# Altium project DBL TLC5940 driver for High load.PrjPcb
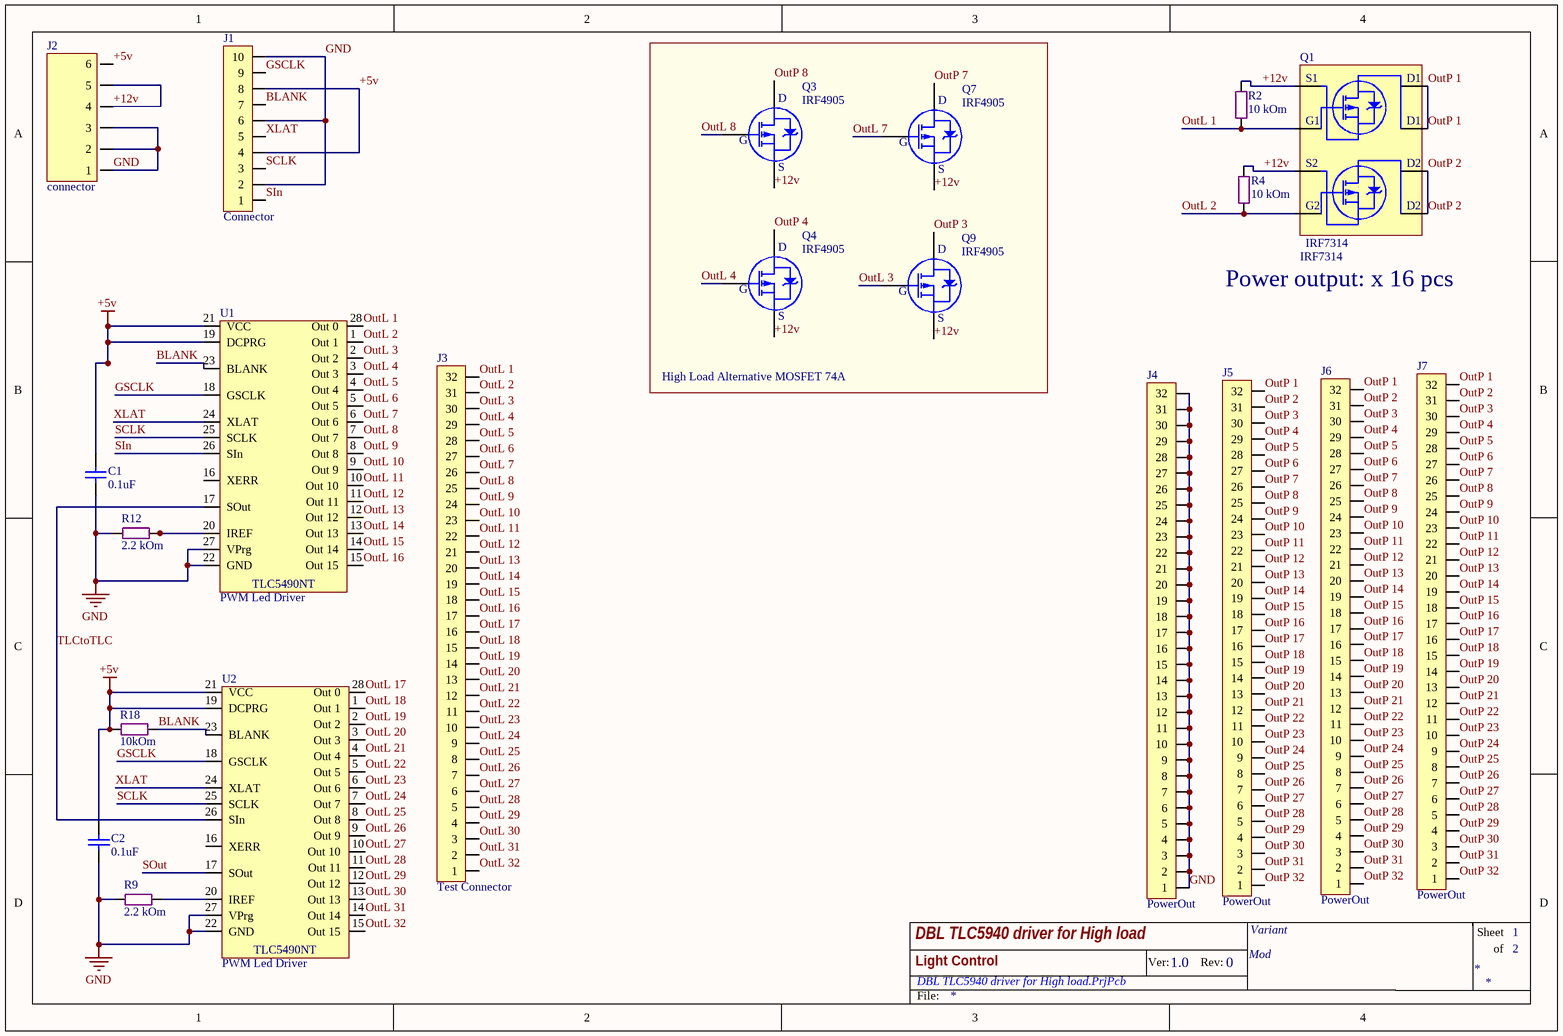
[diagram p0: DBL TLC5940 driver for High load.SchDoc]
2 sheets, 66 parts. Net scope: global (net labels, ports and power ports of the same name join across sheets).
Board file: DBL TLC5940 driver for High load.PcbDoc
Sheets:
  DBL TLC5940 driver for High load.SchDoc
  DBL TLC5940 driver for High load - 5.3A MOSFET.SchDoc

## Sheet DBL TLC5940 driver for High load.SchDoc: DBL TLC5940 driver for High load
size A4; Revision: 0; SheetNumber: 1; SheetTotal: 2; Version: 1.0; Variant: Variant; Modification: Mod; Project: Light Control; PageSetup: Record=PageOptions|CenterHorizontal=True|CenterVertical=True|PrintScale=0.97|XCorrection=1.00|YCorrection=1.00|PrintKind=1|BorderSize=5000000|LeftOffset=0|BottomOffset=0|Orientation=2|PaperLength=2970|PaperWidth=2100|Scale=100|PaperSource=7|PrintQuality=-4|MediaType=1|DitherType=10|PaperKind=A4|PrintScaleMode=1

### Parts
C1  0.1uF  [SMD 0805 (2012)]
C2  0.1uF  [SMD 0805 (2012)]
J1  Connector  [LINE 2.54 x 10D (2 x 5) - BH]
J2  connector  [Molex Mini-Fit Jr - 6Pin R]
J3  Test Connector  [LINE 2.54 x 32]
J4  PowerOut  [LINE 2.54 x 32]
J5  PowerOut  [LINE 2.54 x 32]
J6  PowerOut  [LINE 2.54 x 32]
J7  PowerOut  [LINE 2.54 x 32]
Q1  IRF7314  [SO8]
Q3  IRF4905  [TO220-2]
Q4  IRF4905  [TO220-2]
Q7  IRF4905  [TO220-2]
Q9  IRF4905  [TO220-2]
R2  10 kOm  [SMD 0805 (2012)]
R4  10 kOm  [SMD 0805 (2012)]
R9  2.2 kOm  [SMD 0805 (2012)]
R12  2.2 kOm  [SMD 0805 (2012)]
R18  10kOm  [SMD 0805 (2012)]
U1  PWM Led Driver  [DIP-28 (OVAL)]
U2  PWM Led Driver  [DIP-28 (OVAL)]

### Blocks framed on the sheet
High Load Alternative MOSFET 74A: Q3 Q4 Q7 Q9

### Nets
+5v: C1.1 C2.1 J1.4 J1.8 J2.6 R18.1 U1.19(DCPRG) U1.21(VCC) U2.19(DCPRG) U2.21(VCC)
GND: C1.2 C2.2 J1.2 J1.6 J1.10 J2.1 J2.2 J2.3 J4.1 J4.2 J4.3 J4.4 J4.5 J4.6 J4.7 J4.8 J4.9 J4.10 J4.11 J4.12 J4.13 J4.14 J4.15 J4.16 J4.17 J4.18 J4.19 J4.20 J4.21 J4.22 J4.23 J4.24 J4.25 J4.26 J4.27 J4.28 J4.29 J4.30 J4.31 J4.32 R9.2 R12.2 U1.22(GND) U1.27(VPrg) U2.22(GND) U2.27(VPrg)
+12v: J2.4 J2.5 Q1.1(S) Q1.3(S) Q3.3(S) Q4.3(S) Q7.3(S) Q9.3(S) R2.2 R4.2
BLANK: J1.7 R18.2 U1.23(BLANK) U2.23(BLANK)
GSCLK: J1.9 U1.18(GSCLK) U2.18(GSCLK)
OutL 1: J3.32 Q1.2(G) R2.1 U1.28(Out_0)
OutL 2: J3.31 Q1.4(G) R4.1 U1.1(Out_1)
OutL 3: J3.30 Q9.1(G) U1.2(Out_2)
OutL 4: J3.29 Q4.1(G) U1.3(Out_3)
OutL 5: J3.28 U1.4(Out_4)
OutL 6: J3.27 U1.5(Out_5)
OutL 7: J3.26 Q7.1(G) U1.6(Out_6)
OutL 8: J3.25 Q3.1(G) U1.7(Out_7)
OutL 9: J3.24 U1.8(Out_8)
OutL 10: J3.23 U1.9(Out_9)
OutL 11: J3.22 U1.10(Out_10)
OutL 12: J3.21 U1.11(Out_11)
OutL 13: J3.20 U1.12(Out_12)
OutL 14: J3.19 U1.13(Out_13)
OutL 15: J3.18 U1.14(Out_14)
OutL 16: J3.17 U1.15(Out_15)
OutL 17: J3.16 U2.28(Out_0)
OutL 18: J3.15 U2.1(Out_1)
OutL 19: J3.14 U2.2(Out_2)
OutL 20: J3.13 U2.3(Out_3)
OutL 21: J3.12 U2.4(Out_4)
OutL 22: J3.11 U2.5(Out_5)
OutL 23: J3.10 U2.6(Out_6)
OutL 24: J3.9 U2.7(Out_7)
OutL 25: J3.8 U2.8(Out_8)
OutL 26: J3.7 U2.9(Out_9)
OutL 27: J3.6 U2.10(Out_10)
OutL 28: J3.5 U2.11(Out_11)
OutL 29: J3.4 U2.12(Out_12)
OutL 30: J3.3 U2.13(Out_13)
OutL 31: J3.2 U2.14(Out_14)
OutL 32: J3.1 U2.15(Out_15)
OutP 1: J5.32 J6.32 J7.32 Q1.7(D) Q1.8(D)
OutP 2: J5.31 J6.31 J7.31 Q1.5(D) Q1.6(D)
OutP 3: J5.30 J6.30 J7.30 Q9.2(D)
OutP 4: J5.29 J6.29 J7.29 Q4.2(D)
OutP 5: J5.28 J6.28 J7.28
OutP 6: J5.27 J6.27 J7.27
OutP 7: J5.26 J6.26 J7.26 Q7.2(D)
OutP 8: J5.25 J6.25 J7.25 Q3.2(D)
OutP 9: J5.24 J6.24 J7.24
OutP 10: J5.23 J6.23 J7.23
OutP 11: J5.22 J6.22 J7.22
OutP 12: J5.21 J6.21 J7.21
OutP 13: J5.20 J6.20 J7.20
OutP 14: J5.19 J6.19 J7.19
OutP 15: J5.18 J6.18 J7.18
OutP 16: J5.17 J6.17 J7.17
OutP 17: J5.16 J6.16 J7.16
OutP 18: J5.15 J6.15 J7.15
OutP 19: J5.14 J6.14 J7.14
OutP 20: J5.13 J6.13 J7.13
OutP 21: J5.12 J6.12 J7.12
OutP 22: J5.11 J6.11 J7.11
OutP 23: J5.10 J6.10 J7.10
OutP 24: J5.9 J6.9 J7.9
OutP 25: J5.8 J6.8 J7.8
OutP 26: J5.7 J6.7 J7.7
OutP 27: J5.6 J6.6 J7.6
OutP 28: J5.5 J6.5 J7.5
OutP 29: J5.4 J6.4 J7.4
OutP 30: J5.3 J6.3 J7.3
OutP 31: J5.2 J6.2 J7.2
OutP 32: J5.1 J6.1 J7.1
SCLK: J1.3 U1.25(SCLK) U2.25(SCLK)
SIn: J1.1 U1.26(SIn)
SOut: U2.17(SOut)
TLCtoTLC: U1.17(SOut) U2.26(SIn)
XLAT: J1.5 U1.24(XLAT) U2.24(XLAT)
NetR9_1: R9.1 U2.20(IREF)
NetR12_1: R12.1 U1.20(IREF)

Not connected (* = marked no-connect by the designer): U1 16(XERR); U2 16(XERR)

### Notes on the sheet
- Power output: x 16 pcs
- Ver:
- Rev:
- Sheet
- of
- File:
- (in symbol IRF7314) S1; D1; G1; S2; D2; G2
- (in symbol TLC5940) TLC5490NT

### Library data of the parts
C1 C2 = Cap SMD 0402-1812: Capacitor
J1 = PLD-10 (2 x 5): Vert, Dbl line, Male
J2 = Molex Mini-Fit Jr - 6 pin: Right, Dbl line, Female
J3-J7 = PLS-32: Vert, Sgl line, Male
Q1 = IRF7314: Dual P-Ch  20V - 0.058Ω - 5.3A; Monufacturer: IOR; RDS Сопротивление Сток-Исток: 0.058 Om; I d - Drain current (continuous) at TC = 100°C: 4.3 A; VGS Порог Открытия: -0.7 V; VGS Макс напр на гейте: +-12 V; C ISS Входная емкость: 780 pF; C OSS Выходная емкость: 470 pF; V DSS (v): 20V; I d - Drain current (continuous) at TC = 25°C: 5.3 A; Name: IRF7314; Datasheet: http://tec.org.ru/_bd/2/277_IRF7314-IR.pdf; URL: http://tec.org.ru/board/49-1-0-277
Q3 Q4 Q7 Q9 = IRF4905: P-Channel 55V - 0.02Ω - 74A; Monufacturer: IOR; RDS Сопротивление Сток-Исток: 0.02 Om; I d - Drain current (continuous) at TC = 100°C: 55 A; VGS Порог Открытия: -2....-4 V; VGS Макс напр на гейте: +-20 V; C ISS Входная емкость: 3400 pF; C OSS Выходная емкость: 1400 pF; V DSS (v): 55V; I d - Drain current (continuous) at TC = 25°C: 74 A; Name: IRF4905; Datasheet: http://tec.org.ru/_bd/32/3287_IRF4905.pdf; URL: http://tec.org.ru/board/irf4905/49-1-0-3287
R2 R4 R9 R12 R18 = Res All Types
U1 U2 = TLC5940: 16-Channel LED Driver With DOT Correction and Grayscale PWM Control; DataSheet: http://www.ti.com/lit/ds/symlink/tlc5940.pdf

## Sheet DBL TLC5940 driver for High load - 5.3A MOSFET.SchDoc: DBL TLC5940 driver for High load - 5.3A MOSFET
size A4; Revision: 0; SheetNumber: 2; SheetTotal: 2; Version: 1.0; Variant: 5.3 A MOSFET; Modification: Mod; Project: Light Control
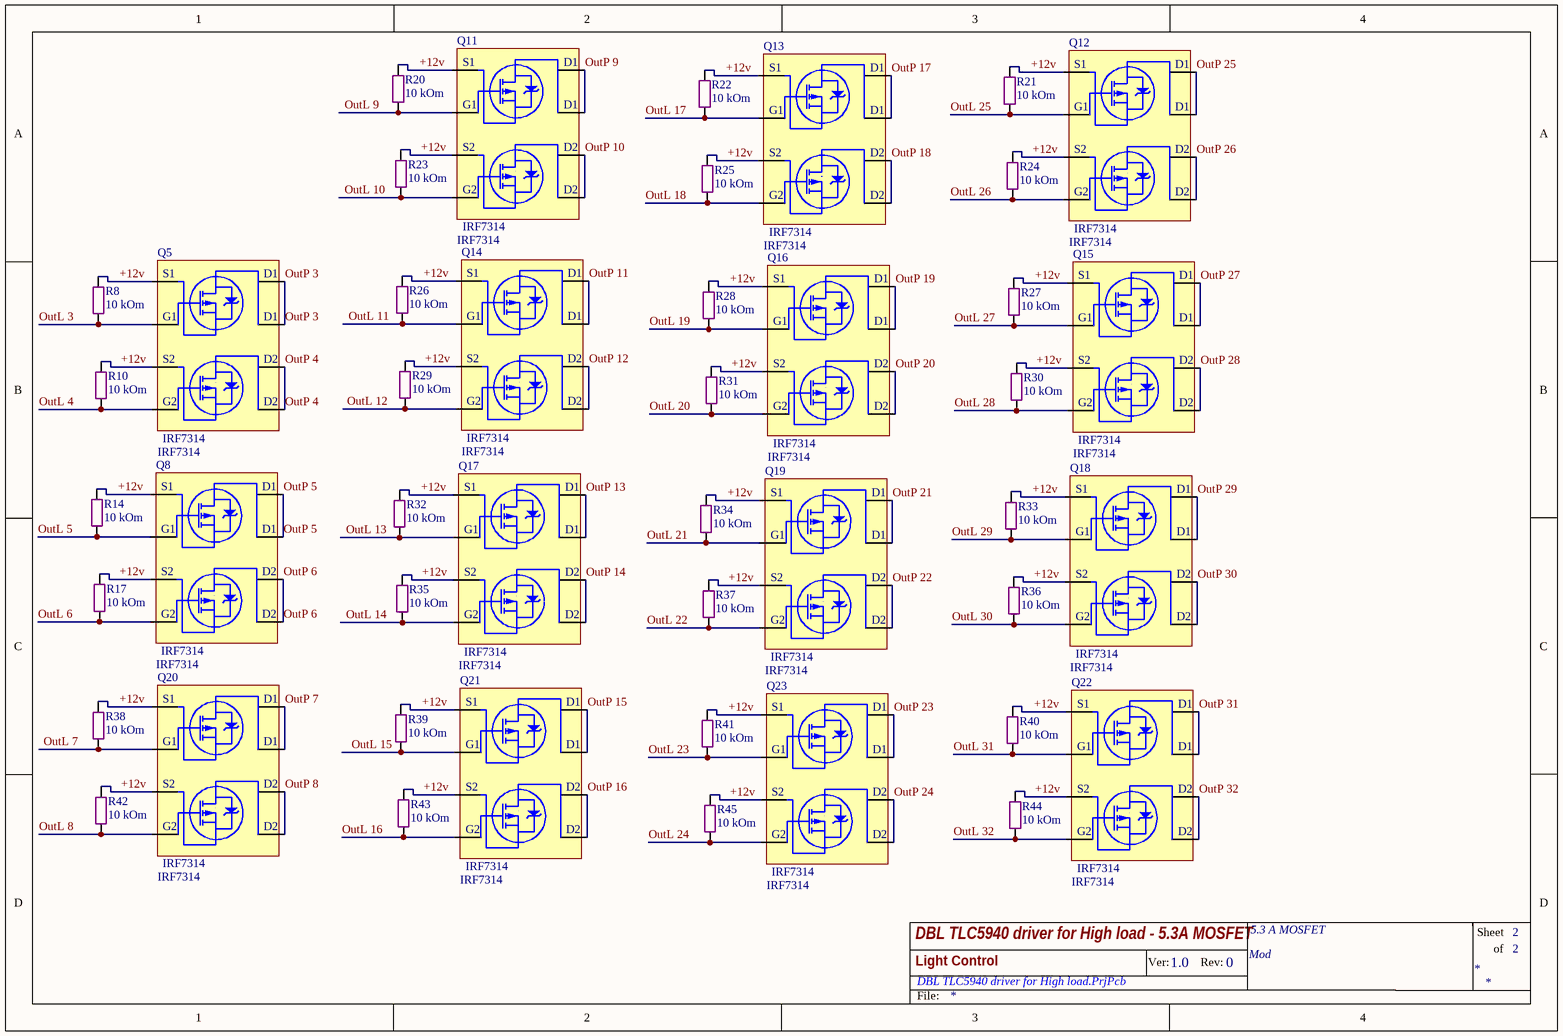
[diagram p1: DBL TLC5940 driver for High load - 5.3A MOSFET.SchDoc]

### Parts
Q5  IRF7314  [SO8]
Q8  IRF7314  [SO8]
Q11  IRF7314  [SO8]
Q12  IRF7314  [SO8]
Q13  IRF7314  [SO8]
Q14  IRF7314  [SO8]
Q15  IRF7314  [SO8]
Q16  IRF7314  [SO8]
Q17  IRF7314  [SO8]
Q18  IRF7314  [SO8]
Q19  IRF7314  [SO8]
Q20  IRF7314  [SO8]
Q21  IRF7314  [SO8]
Q22  IRF7314  [SO8]
Q23  IRF7314  [SO8]
R8  10 kOm  [SMD 0805 (2012)]
R10  10 kOm  [SMD 0805 (2012)]
R14  10 kOm  [SMD 0805 (2012)]
R17  10 kOm  [SMD 0805 (2012)]
R20  10 kOm  [SMD 0805 (2012)]
R21  10 kOm  [SMD 0805 (2012)]
R22  10 kOm  [SMD 0805 (2012)]
R23  10 kOm  [SMD 0805 (2012)]
R24  10 kOm  [SMD 0805 (2012)]
R25  10 kOm  [SMD 0805 (2012)]
R26  10 kOm  [SMD 0805 (2012)]
R27  10 kOm  [SMD 0805 (2012)]
R28  10 kOm  [SMD 0805 (2012)]
R29  10 kOm  [SMD 0805 (2012)]
R30  10 kOm  [SMD 0805 (2012)]
R31  10 kOm  [SMD 0805 (2012)]
R32  10 kOm  [SMD 0805 (2012)]
R33  10 kOm  [SMD 0805 (2012)]
R34  10 kOm  [SMD 0805 (2012)]
R35  10 kOm  [SMD 0805 (2012)]
R36  10 kOm  [SMD 0805 (2012)]
R37  10 kOm  [SMD 0805 (2012)]
R38  10 kOm  [SMD 0805 (2012)]
R39  10 kOm  [SMD 0805 (2012)]
R40  10 kOm  [SMD 0805 (2012)]
R41  10 kOm  [SMD 0805 (2012)]
R42  10 kOm  [SMD 0805 (2012)]
R43  10 kOm  [SMD 0805 (2012)]
R44  10 kOm  [SMD 0805 (2012)]
R45  10 kOm  [SMD 0805 (2012)]

### Nets
+12v: Q5.1(S) Q5.3(S) Q8.1(S) Q8.3(S) Q11.1(S) Q11.3(S) Q12.1(S) Q12.3(S) Q13.1(S) Q13.3(S) Q14.1(S) Q14.3(S) Q15.1(S) Q15.3(S) Q16.1(S) Q16.3(S) Q17.1(S) Q17.3(S) Q18.1(S) Q18.3(S) Q19.1(S) Q19.3(S) Q20.1(S) Q20.3(S) Q21.1(S) Q21.3(S) Q22.1(S) Q22.3(S) Q23.1(S) Q23.3(S) R8.2 R10.2 R14.2 R17.2 R20.2 R21.2 R22.2 R23.2 R24.2 R25.2 R26.2 R27.2 R28.2 R29.2 R30.2 R31.2 R32.2 R33.2 R34.2 R35.2 R36.2 R37.2 R38.2 R39.2 R40.2 R41.2 R42.2 R43.2 R44.2 R45.2
OutL 3: Q5.2(G) R8.1
OutL 4: Q5.4(G) R10.1
OutL 5: Q8.2(G) R14.1
OutL 6: Q8.4(G) R17.1
OutL 7: Q20.2(G) R38.1
OutL 8: Q20.4(G) R42.1
OutL 9: Q11.2(G) R20.1
OutL 10: Q11.4(G) R23.1
OutL 11: Q14.2(G) R26.1
OutL 12: Q14.4(G) R29.1
OutL 13: Q17.2(G) R32.1
OutL 14: Q17.4(G) R35.1
OutL 15: Q21.2(G) R39.1
OutL 16: Q21.4(G) R43.1
OutL 17: Q13.2(G) R22.1
OutL 18: Q13.4(G) R25.1
OutL 19: Q16.2(G) R28.1
OutL 20: Q16.4(G) R31.1
OutL 21: Q19.2(G) R34.1
OutL 22: Q19.4(G) R37.1
OutL 23: Q23.2(G) R41.1
OutL 24: Q23.4(G) R45.1
OutL 25: Q12.2(G) R21.1
OutL 26: Q12.4(G) R24.1
OutL 27: Q15.2(G) R27.1
OutL 28: Q15.4(G) R30.1
OutL 29: Q18.2(G) R33.1
OutL 30: Q18.4(G) R36.1
OutL 31: Q22.2(G) R40.1
OutL 32: Q22.4(G) R44.1
OutP 3: Q5.7(D) Q5.8(D)
OutP 4: Q5.5(D) Q5.6(D)
OutP 5: Q8.7(D) Q8.8(D)
OutP 6: Q8.5(D) Q8.6(D)
OutP 7: Q20.7(D) Q20.8(D)
OutP 8: Q20.5(D) Q20.6(D)
OutP 9: Q11.7(D) Q11.8(D)
OutP 10: Q11.5(D) Q11.6(D)
OutP 11: Q14.7(D) Q14.8(D)
OutP 12: Q14.5(D) Q14.6(D)
OutP 13: Q17.7(D) Q17.8(D)
OutP 14: Q17.5(D) Q17.6(D)
OutP 15: Q21.7(D) Q21.8(D)
OutP 16: Q21.5(D) Q21.6(D)
OutP 17: Q13.7(D) Q13.8(D)
OutP 18: Q13.5(D) Q13.6(D)
OutP 19: Q16.7(D) Q16.8(D)
OutP 20: Q16.5(D) Q16.6(D)
OutP 21: Q19.7(D) Q19.8(D)
OutP 22: Q19.5(D) Q19.6(D)
OutP 23: Q23.7(D) Q23.8(D)
OutP 24: Q23.5(D) Q23.6(D)
OutP 25: Q12.7(D) Q12.8(D)
OutP 26: Q12.5(D) Q12.6(D)
OutP 27: Q15.7(D) Q15.8(D)
OutP 28: Q15.5(D) Q15.6(D)
OutP 29: Q18.7(D) Q18.8(D)
OutP 30: Q18.5(D) Q18.6(D)
OutP 31: Q22.7(D) Q22.8(D)
OutP 32: Q22.5(D) Q22.6(D)

### Notes on the sheet
- Ver:
- Rev:
- Sheet
- of
- File:
- (in symbol IRF7314) S1; D1; G1; S2; D2; G2

### Library data of the parts
Q5 Q8 Q11-Q23 = IRF7314: as Q1 on sheet DBL TLC5940 driver for High load; V DSS (v): 20V; I d - Drain current (continuous) at TC = 25°C: 5.3 A; Name: IRF7314; Datasheet: http://tec.org.ru/_bd/2/277_IRF7314-IR.pdf; URL: http://tec.org.ru/board/49-1-0-277
R8 R10 R14 R17 R20-R45 = Res All Types

## Nets that join several sheets
+12v: DBL TLC5940 driver for High load (10 pins), DBL TLC5940 driver for High load - 5.3A MOSFET (60 pins)
OutL 3: DBL TLC5940 driver for High load (J3.30 Q9.1 U1.2), DBL TLC5940 driver for High load - 5.3A MOSFET (Q5.2 R8.1)
OutL 4: DBL TLC5940 driver for High load (J3.29 Q4.1 U1.3), DBL TLC5940 driver for High load - 5.3A MOSFET (Q5.4 R10.1)
OutL 5: DBL TLC5940 driver for High load (J3.28 U1.4), DBL TLC5940 driver for High load - 5.3A MOSFET (Q8.2 R14.1)
OutL 6: DBL TLC5940 driver for High load (J3.27 U1.5), DBL TLC5940 driver for High load - 5.3A MOSFET (Q8.4 R17.1)
OutL 7: DBL TLC5940 driver for High load (J3.26 Q7.1 U1.6), DBL TLC5940 driver for High load - 5.3A MOSFET (Q20.2 R38.1)
OutL 8: DBL TLC5940 driver for High load (J3.25 Q3.1 U1.7), DBL TLC5940 driver for High load - 5.3A MOSFET (Q20.4 R42.1)
OutL 9: DBL TLC5940 driver for High load (J3.24 U1.8), DBL TLC5940 driver for High load - 5.3A MOSFET (Q11.2 R20.1)
OutL 10: DBL TLC5940 driver for High load (J3.23 U1.9), DBL TLC5940 driver for High load - 5.3A MOSFET (Q11.4 R23.1)
OutL 11: DBL TLC5940 driver for High load (J3.22 U1.10), DBL TLC5940 driver for High load - 5.3A MOSFET (Q14.2 R26.1)
OutL 12: DBL TLC5940 driver for High load (J3.21 U1.11), DBL TLC5940 driver for High load - 5.3A MOSFET (Q14.4 R29.1)
OutL 13: DBL TLC5940 driver for High load (J3.20 U1.12), DBL TLC5940 driver for High load - 5.3A MOSFET (Q17.2 R32.1)
OutL 14: DBL TLC5940 driver for High load (J3.19 U1.13), DBL TLC5940 driver for High load - 5.3A MOSFET (Q17.4 R35.1)
OutL 15: DBL TLC5940 driver for High load (J3.18 U1.14), DBL TLC5940 driver for High load - 5.3A MOSFET (Q21.2 R39.1)
OutL 16: DBL TLC5940 driver for High load (J3.17 U1.15), DBL TLC5940 driver for High load - 5.3A MOSFET (Q21.4 R43.1)
OutL 17: DBL TLC5940 driver for High load (J3.16 U2.28), DBL TLC5940 driver for High load - 5.3A MOSFET (Q13.2 R22.1)
OutL 18: DBL TLC5940 driver for High load (J3.15 U2.1), DBL TLC5940 driver for High load - 5.3A MOSFET (Q13.4 R25.1)
OutL 19: DBL TLC5940 driver for High load (J3.14 U2.2), DBL TLC5940 driver for High load - 5.3A MOSFET (Q16.2 R28.1)
OutL 20: DBL TLC5940 driver for High load (J3.13 U2.3), DBL TLC5940 driver for High load - 5.3A MOSFET (Q16.4 R31.1)
OutL 21: DBL TLC5940 driver for High load (J3.12 U2.4), DBL TLC5940 driver for High load - 5.3A MOSFET (Q19.2 R34.1)
OutL 22: DBL TLC5940 driver for High load (J3.11 U2.5), DBL TLC5940 driver for High load - 5.3A MOSFET (Q19.4 R37.1)
OutL 23: DBL TLC5940 driver for High load (J3.10 U2.6), DBL TLC5940 driver for High load - 5.3A MOSFET (Q23.2 R41.1)
OutL 24: DBL TLC5940 driver for High load (J3.9 U2.7), DBL TLC5940 driver for High load - 5.3A MOSFET (Q23.4 R45.1)
OutL 25: DBL TLC5940 driver for High load (J3.8 U2.8), DBL TLC5940 driver for High load - 5.3A MOSFET (Q12.2 R21.1)
OutL 26: DBL TLC5940 driver for High load (J3.7 U2.9), DBL TLC5940 driver for High load - 5.3A MOSFET (Q12.4 R24.1)
OutL 27: DBL TLC5940 driver for High load (J3.6 U2.10), DBL TLC5940 driver for High load - 5.3A MOSFET (Q15.2 R27.1)
OutL 28: DBL TLC5940 driver for High load (J3.5 U2.11), DBL TLC5940 driver for High load - 5.3A MOSFET (Q15.4 R30.1)
OutL 29: DBL TLC5940 driver for High load (J3.4 U2.12), DBL TLC5940 driver for High load - 5.3A MOSFET (Q18.2 R33.1)
OutL 30: DBL TLC5940 driver for High load (J3.3 U2.13), DBL TLC5940 driver for High load - 5.3A MOSFET (Q18.4 R36.1)
OutL 31: DBL TLC5940 driver for High load (J3.2 U2.14), DBL TLC5940 driver for High load - 5.3A MOSFET (Q22.2 R40.1)
OutL 32: DBL TLC5940 driver for High load (J3.1 U2.15), DBL TLC5940 driver for High load - 5.3A MOSFET (Q22.4 R44.1)
OutP 3: DBL TLC5940 driver for High load (J5.30 J6.30 J7.30 Q9.2), DBL TLC5940 driver for High load - 5.3A MOSFET (Q5.7 Q5.8)
OutP 4: DBL TLC5940 driver for High load (J5.29 J6.29 J7.29 Q4.2), DBL TLC5940 driver for High load - 5.3A MOSFET (Q5.5 Q5.6)
OutP 5: DBL TLC5940 driver for High load (J5.28 J6.28 J7.28), DBL TLC5940 driver for High load - 5.3A MOSFET (Q8.7 Q8.8)
OutP 6: DBL TLC5940 driver for High load (J5.27 J6.27 J7.27), DBL TLC5940 driver for High load - 5.3A MOSFET (Q8.5 Q8.6)
OutP 7: DBL TLC5940 driver for High load (J5.26 J6.26 J7.26 Q7.2), DBL TLC5940 driver for High load - 5.3A MOSFET (Q20.7 Q20.8)
OutP 8: DBL TLC5940 driver for High load (J5.25 J6.25 J7.25 Q3.2), DBL TLC5940 driver for High load - 5.3A MOSFET (Q20.5 Q20.6)
OutP 9: DBL TLC5940 driver for High load (J5.24 J6.24 J7.24), DBL TLC5940 driver for High load - 5.3A MOSFET (Q11.7 Q11.8)
OutP 10: DBL TLC5940 driver for High load (J5.23 J6.23 J7.23), DBL TLC5940 driver for High load - 5.3A MOSFET (Q11.5 Q11.6)
OutP 11: DBL TLC5940 driver for High load (J5.22 J6.22 J7.22), DBL TLC5940 driver for High load - 5.3A MOSFET (Q14.7 Q14.8)
OutP 12: DBL TLC5940 driver for High load (J5.21 J6.21 J7.21), DBL TLC5940 driver for High load - 5.3A MOSFET (Q14.5 Q14.6)
OutP 13: DBL TLC5940 driver for High load (J5.20 J6.20 J7.20), DBL TLC5940 driver for High load - 5.3A MOSFET (Q17.7 Q17.8)
OutP 14: DBL TLC5940 driver for High load (J5.19 J6.19 J7.19), DBL TLC5940 driver for High load - 5.3A MOSFET (Q17.5 Q17.6)
OutP 15: DBL TLC5940 driver for High load (J5.18 J6.18 J7.18), DBL TLC5940 driver for High load - 5.3A MOSFET (Q21.7 Q21.8)
OutP 16: DBL TLC5940 driver for High load (J5.17 J6.17 J7.17), DBL TLC5940 driver for High load - 5.3A MOSFET (Q21.5 Q21.6)
OutP 17: DBL TLC5940 driver for High load (J5.16 J6.16 J7.16), DBL TLC5940 driver for High load - 5.3A MOSFET (Q13.7 Q13.8)
OutP 18: DBL TLC5940 driver for High load (J5.15 J6.15 J7.15), DBL TLC5940 driver for High load - 5.3A MOSFET (Q13.5 Q13.6)
OutP 19: DBL TLC5940 driver for High load (J5.14 J6.14 J7.14), DBL TLC5940 driver for High load - 5.3A MOSFET (Q16.7 Q16.8)
OutP 20: DBL TLC5940 driver for High load (J5.13 J6.13 J7.13), DBL TLC5940 driver for High load - 5.3A MOSFET (Q16.5 Q16.6)
OutP 21: DBL TLC5940 driver for High load (J5.12 J6.12 J7.12), DBL TLC5940 driver for High load - 5.3A MOSFET (Q19.7 Q19.8)
OutP 22: DBL TLC5940 driver for High load (J5.11 J6.11 J7.11), DBL TLC5940 driver for High load - 5.3A MOSFET (Q19.5 Q19.6)
OutP 23: DBL TLC5940 driver for High load (J5.10 J6.10 J7.10), DBL TLC5940 driver for High load - 5.3A MOSFET (Q23.7 Q23.8)
OutP 24: DBL TLC5940 driver for High load (J5.9 J6.9 J7.9), DBL TLC5940 driver for High load - 5.3A MOSFET (Q23.5 Q23.6)
OutP 25: DBL TLC5940 driver for High load (J5.8 J6.8 J7.8), DBL TLC5940 driver for High load - 5.3A MOSFET (Q12.7 Q12.8)
OutP 26: DBL TLC5940 driver for High load (J5.7 J6.7 J7.7), DBL TLC5940 driver for High load - 5.3A MOSFET (Q12.5 Q12.6)
OutP 27: DBL TLC5940 driver for High load (J5.6 J6.6 J7.6), DBL TLC5940 driver for High load - 5.3A MOSFET (Q15.7 Q15.8)
OutP 28: DBL TLC5940 driver for High load (J5.5 J6.5 J7.5), DBL TLC5940 driver for High load - 5.3A MOSFET (Q15.5 Q15.6)
OutP 29: DBL TLC5940 driver for High load (J5.4 J6.4 J7.4), DBL TLC5940 driver for High load - 5.3A MOSFET (Q18.7 Q18.8)
OutP 30: DBL TLC5940 driver for High load (J5.3 J6.3 J7.3), DBL TLC5940 driver for High load - 5.3A MOSFET (Q18.5 Q18.6)
OutP 31: DBL TLC5940 driver for High load (J5.2 J6.2 J7.2), DBL TLC5940 driver for High load - 5.3A MOSFET (Q22.7 Q22.8)
OutP 32: DBL TLC5940 driver for High load (J5.1 J6.1 J7.1), DBL TLC5940 driver for High load - 5.3A MOSFET (Q22.5 Q22.6)